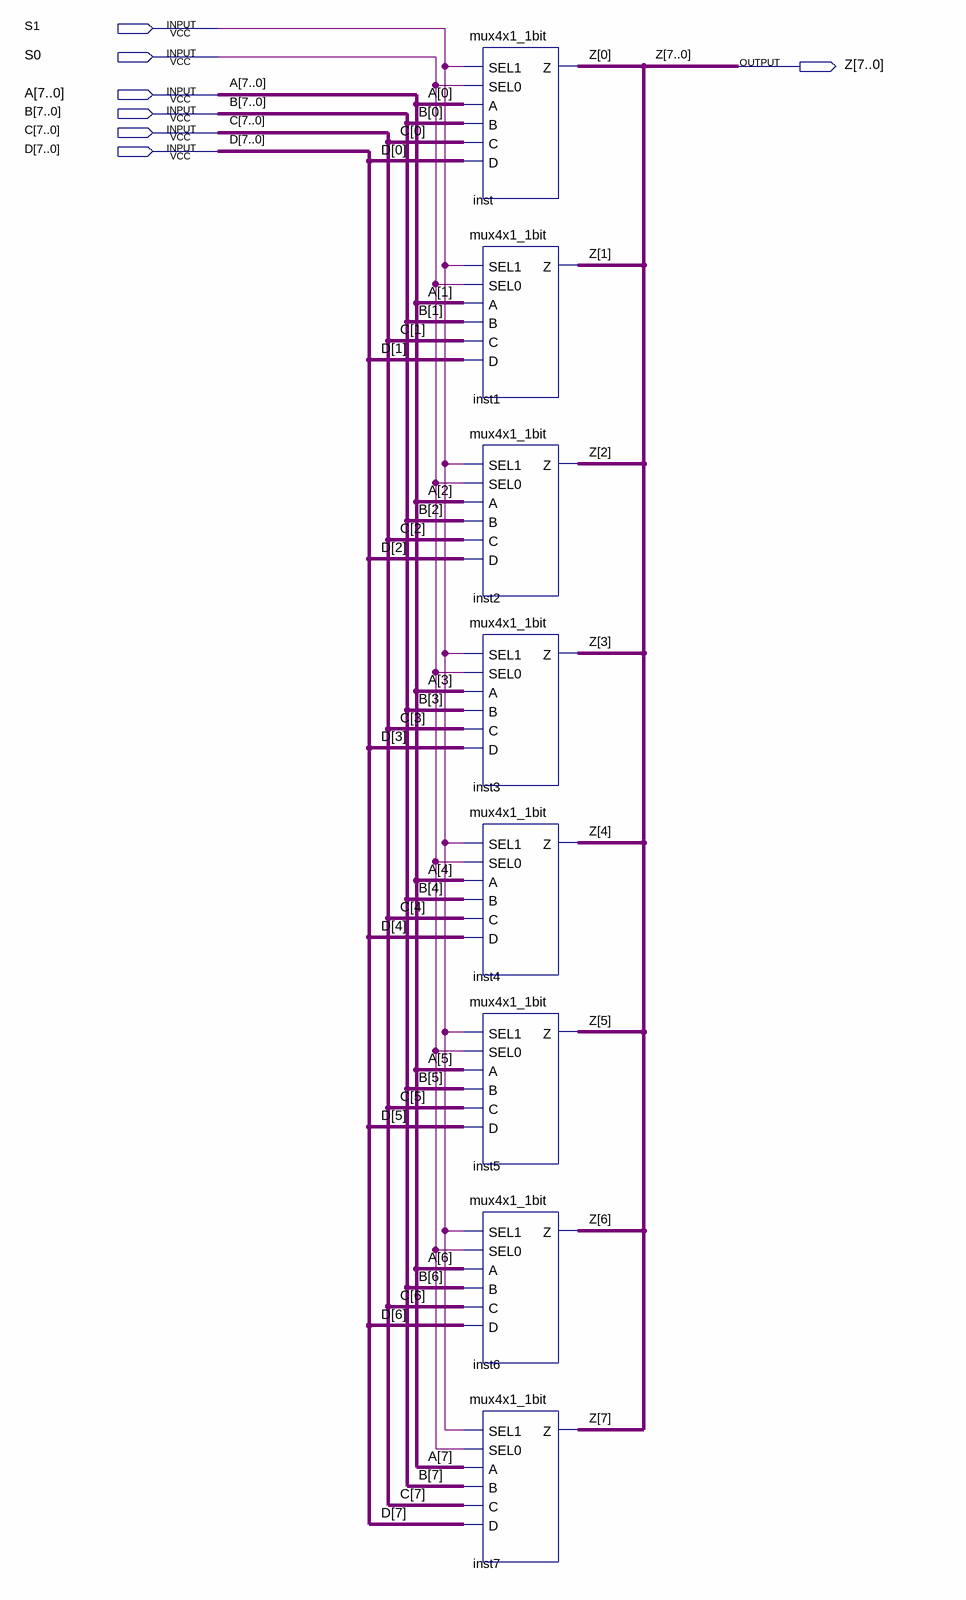
[diagram p0: schematic sheet]
// Quartus schematic mux4x1_8bit.bdf as structural Verilog: 8 symbols, 7 pins
module mux4x1_8bit (
  input  S1,
  input  S0,
  input  [7:0] A,
  input  [7:0] B,
  input  [7:0] C,
  input  [7:0] D,
  output [7:0] Z
);

  mux4x1_1bit inst (.SEL1(S1), .SEL0(S0), .A(A[0]), .B(B[0]), .C(C[0]), .D(D[0]), .Z(Z[0]));
  mux4x1_1bit inst1 (.SEL1(S1), .SEL0(S0), .A(A[1]), .B(B[1]), .C(C[1]), .D(D[1]), .Z(Z[1]));
  mux4x1_1bit inst2 (.SEL1(S1), .SEL0(S0), .A(A[2]), .B(B[2]), .C(C[2]), .D(D[2]), .Z(Z[2]));
  mux4x1_1bit inst3 (.SEL1(S1), .SEL0(S0), .A(A[3]), .B(B[3]), .C(C[3]), .D(D[3]), .Z(Z[3]));
  mux4x1_1bit inst4 (.SEL1(S1), .SEL0(S0), .A(A[4]), .B(B[4]), .C(C[4]), .D(D[4]), .Z(Z[4]));
  mux4x1_1bit inst5 (.SEL1(S1), .SEL0(S0), .A(A[5]), .B(B[5]), .C(C[5]), .D(D[5]), .Z(Z[5]));
  mux4x1_1bit inst6 (.SEL1(S1), .SEL0(S0), .A(A[6]), .B(B[6]), .C(C[6]), .D(D[6]), .Z(Z[6]));
  mux4x1_1bit inst7 (.SEL1(S1), .SEL0(S0), .A(A[7]), .B(B[7]), .C(C[7]), .D(D[7]), .Z(Z[7]));
endmodule
